# EAGLE design 1280 V2 SMPS (EAGLE 8.2.2)

## Sheet 1 of 3
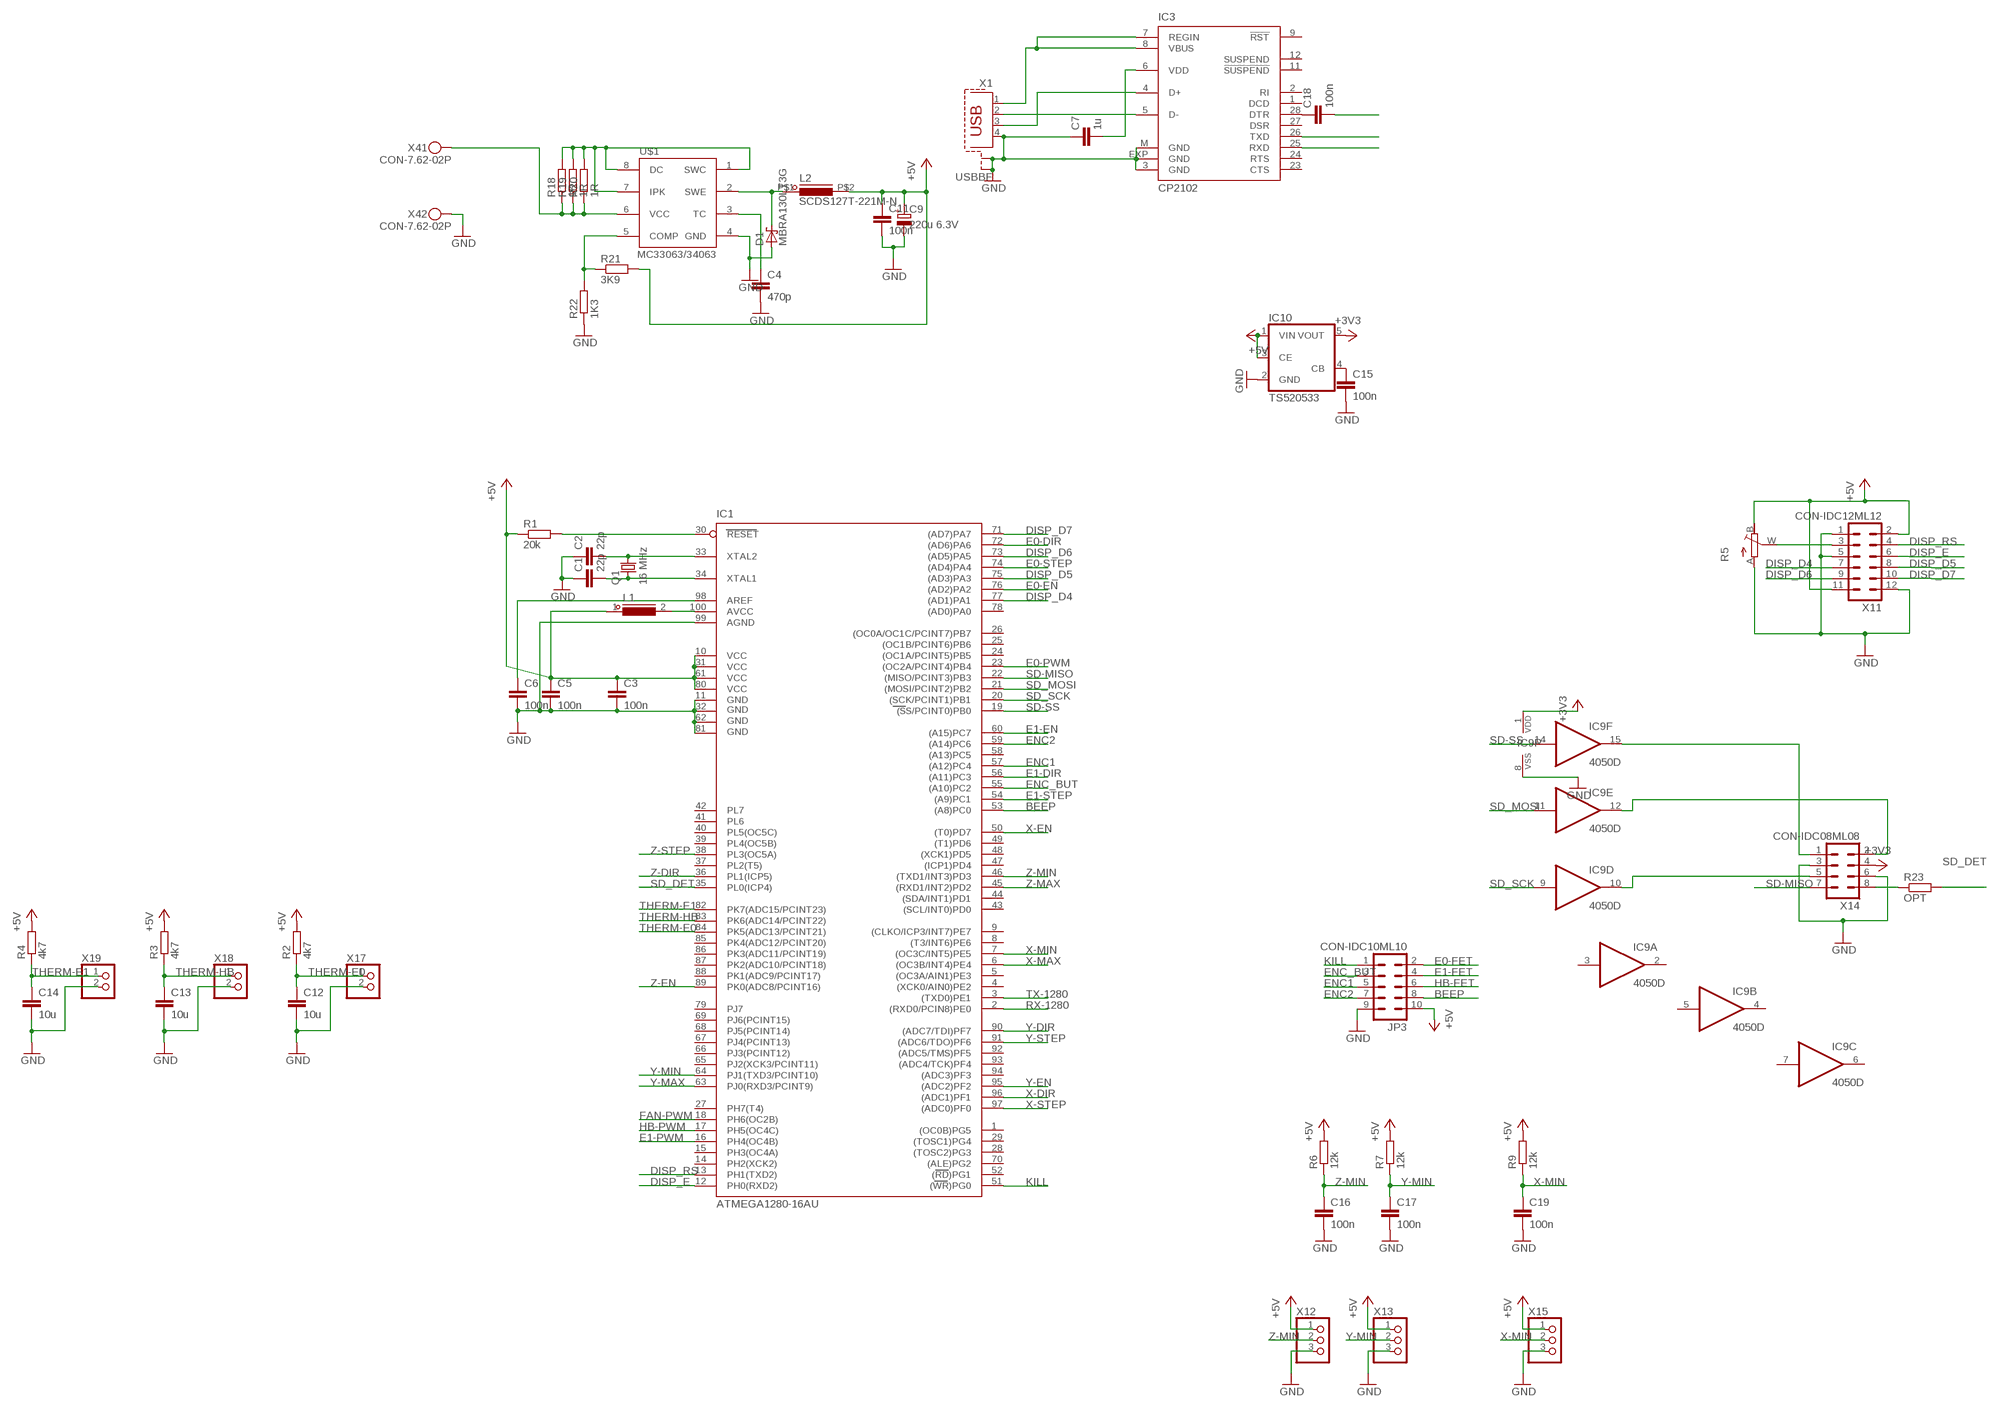
[diagram p0: schematic, sheet 1]

### Parts
C1  22p  CAP_0805  [C0805]
C2  22p  CAP_0805  [C0805]
C3  100n  CAP_0805  [C0805]
C4  470p  CAP_0805  [C0805]
C5  100n  CAP_0805  [C0805]
C6  100n  CAP_0805  [C0805]
C7  1u  CAP_0805  [C0805]
C9  220u 6.3V  CAP-POL_D6  [153CLV-0605]
C11  100n  CAP_0805  [C0805]
C12  10u  CAP_1210  [C1210]
C13  10u  CAP_1210  [C1210]
C14  10u  CAP_1210  [C1210]
C15  100n  CAP_0805  [C0805]
C16  100n  CAP_0805  [C0805]
C17  100n  CAP_0805  [C0805]
C18  100n  CAP_0805  [C0805]
C19  100n  CAP_0805  [C0805]
D1  MBRA130LT3G  DIODE-SH_SMA  [DO214AC]
IC1  ATMEGA1280-16AU  [TQFP100]
IC3  CP2102  [MLP28]
IC9  4050D  [SO16]
IC10  TS520533  [SOT25]
JP3  CON-IDC10ML10  [ML10]
L1  INDUCTOR1210  [C1210]
L2  SCDS127T-221M-N  INDUCTOR0705  [SCD-0705]
Q1  16 MHz  CRYSTAL3225  [CRYSTAL-3225]
R1  20k  R_0805  [R0805]
R2  4k7  R_0805  [R0805]
R3  4k7  R_0805  [R0805]
R4  4k7  R_0805  [R0805]
R5  R_POTTURN-X  [RJ9W]
R6  12k  R_0805  [R0805]
R7  12k  R_0805  [R0805]
R9  12k  R_0805  [R0805]
R18  1R  R_0805  [R0805]
R19  1R  R_0805  [R0805]
R20  1R  R_0805  [R0805]
R21  3K9  R_0805  [R0805]
R22  1K3  R_0805  [R0805]
R23  OPT  R_0805  [R0805]
U$1  MC33063/MC34063D  [SO08]
X1  USBBF  [PN61729-S]
X4  CON-7.62-02P  [KF25C-7.62-02P-13]
X11  CON-IDC12ML12  [ML12]
X12  PINHD-1X3  [1X03]
X13  PINHD-1X3  [1X03]
X14  CON-IDC08ML08  [ML08]
X15  PINHD-1X3  [1X03]
X17  PINHD-1X2  [1X02]
X18  PINHD-1X2  [1X02]
X19  PINHD-1X2  [1X02]

### Nets
!RST: C18.2 IC1.30(RESET) R1.2
+3V3: IC9.1(P:VDD) IC10.5(VOUT) X14.4
+5V: C3.1 C5.1 C9.+ C11.1 IC1.10(VCC) IC1.31(VCC1) IC1.61(VCC2) IC1.80(VCC3) IC10.1(VIN) IC10.3(CE) JP3.10 L1.1 L2.P$2 R1.1 R2.2 R3.2 R4.2 R5.B(E) R6.2 R7.2 R9.2 R21.2 X11.2 X11.11 X12.1 X13.1 X15.1 ; also sheet 3
AREF: C6.1 IC1.98(AREF)
AVCC: IC1.100(AVCC) L1.2
BEEP: IC1.53((A8)PC0) JP3.8
DISP_D4: IC1.77((AD1)PA1) X11.7
DISP_D5: IC1.75((AD3)PA3) X11.8
DISP_D6: IC1.73((AD5)PA5) X11.9
DISP_D7: IC1.71((AD7)PA7) X11.10
DISP_E: IC1.12(PH0(RXD2)) X11.6
DISP_RS: IC1.13(PH1(TXD2)) X11.4
E0-DIR: IC1.72((AD6)PA6) ; also sheet 3
E0-EN: IC1.76((AD2)PA2) ; also sheet 3
E0-FET: JP3.2 ; also sheet 2
E0-PWM: IC1.23((OC2A/PCINT4)PB4) ; also sheet 2
E0-STEP: IC1.74((AD4)PA4) ; also sheet 3
E1-DIR: IC1.56((A11)PC3) ; also sheet 3
E1-EN: IC1.60((A15)PC7) ; also sheet 3
E1-FET: JP3.4 ; also sheet 2
E1-PWM: IC1.16(PH4(OC4B)) ; also sheet 2
E1-STEP: IC1.54((A9)PC1) ; also sheet 3
ENC1: IC1.57((A12)PC4) JP3.5
ENC2: IC1.59((A14)PC6) JP3.7
ENC_BUT: IC1.55((A10)PC2) JP3.3
FAN-PWM: IC1.18(PH6(OC2B)) ; also sheet 2
GND: C1.1 C2.1 C3.2 C4.2 C5.2 C6.2 C7.1 C9.- C11.2 C12.2 C13.2 C14.2 C15.2 C16.2 C17.2 C19.2 D1.A IC1.11(GND) IC1.32(GND1) IC1.62(GND2) IC1.81(GND3) IC1.99(AGND) IC3.3(GND) IC3.EXP(GND) IC3.M(GND) IC9.8(P:VSS) IC10.2(GND) JP3.9 R5.A R22.1 U$1.4(GND) X1.4(GND) X1.S1 X1.S2 X4.P$2 X11.1 X11.5 X11.12 X12.3 X13.3 X14.3 X14.6 X15.3 X17.2 X18.2 X19.2 ; also sheet 2,3
HB-FET: JP3.6 ; also sheet 2
HB-PWM: IC1.17(PH5(OC4C)) ; also sheet 2
KILL: IC1.51((WR)PG0) JP3.1
N$1: IC3.5(D-) X1.2(D-)
N$2: IC3.4(D+) X1.3(D+)
N$4: C7.2 IC3.6(VDD)
N$44: C18.1 IC3.28(DTR)
N$45: IC3.7(REGIN) IC3.8(VBUS) X1.1(VCC)
N$47: R5.W(S) X11.3
N$48: R23.1 X14.8
N$49: IC9.15(F:O) X14.1
N$50: IC9.12(E:O) X14.2
N$51: IC9.10(D:O) X14.5
N$52: C15.1 IC10.4(CB)
N$55: R18.2 R19.2 R20.2 U$1.1(SWC) U$1.7(IPK) U$1.8(DC)
N$56: D1.C L2.P$1 U$1.2(SWE)
N$57: C4.1 U$1.3(TC)
N$59: R21.1 R22.2 U$1.5(COMP)
RX-1280: IC1.2((RXD0/PCIN8)PE0) IC3.26(TXD)
SD-MISO: IC1.22((MISO/PCINT3)PB3) X14.7
SD-SS: IC1.19((SS/PCINT0)PB0) IC9.14(F:I)
SD_DET: IC1.35(PL0(ICP4)) R23.2
SD_MOSI: IC1.21((MOSI/PCINT2)PB2) IC9.11(E:I)
SD_SCK: IC1.20((SCK/PCINT1)PB1) IC9.9(D:I)
THERM-E0: C12.1 IC1.84(PK5(ADC13/PCINT21)) R2.1 X17.1
THERM-E1: C14.1 IC1.82(PK7(ADC15/PCINT23)) R4.1 X19.1
THERM-HB: C13.1 IC1.83(PK6(ADC14/PCINT22)) R3.1 X18.1
TX-1280: IC1.3((TXD0)PE1) IC3.25(RXD)
V-IN: R18.1 R19.1 R20.1 U$1.6(VCC) X4.P$1 ; also sheet 2,3
X-DIR: IC1.96((ADC1)PF1) ; also sheet 3
X-EN: IC1.50((T0)PD7) ; also sheet 3
X-MAX: IC1.6((OC3B/INT4)PE4)
X-MIN: C19.1 IC1.7((OC3C/INT5)PE5) R9.1 X15.2
X-STEP: IC1.97((ADC0)PF0) ; also sheet 3
XTAL1: C1.2 IC1.34(XTAL1) Q1.P$2
XTAL2: C2.2 IC1.33(XTAL2) Q1.P$4
Y-DIR: IC1.90((ADC7/TDI)PF7) ; also sheet 3
Y-EN: IC1.95((ADC2)PF2) ; also sheet 3
Y-MAX: IC1.63(PJ0(RXD3/PCINT9))
Y-MIN: C17.1 IC1.64(PJ1(TXD3/PCINT10)) R7.1 X13.2
Y-STEP: IC1.91((ADC6/TDO)PF6) ; also sheet 3
Z-DIR: IC1.36(PL1(ICP5)) ; also sheet 3
Z-EN: IC1.89(PK0(ADC8/PCINT16)) ; also sheet 3
Z-MAX: IC1.45((RXD1/INT2)PD2)
Z-MIN: C16.1 IC1.46((TXD1/INT3)PD3) R6.1 X12.2
Z-STEP: IC1.38(PL3(OC5A)) ; also sheet 3
Unconnected: IC1.1((OC0B)PG5) IC1.4((XCK0/AIN0)PE2) IC1.5((OC3A/AIN1)PE3) IC1.8((T3/INT6)PE6) IC1.9((CLKO/ICP3/INT7)PE7) IC1.14(PH2(XCK2)) IC1.15(PH3(OC4A)) IC1.24((OC1A/PCINT5)PB5) IC1.25((OC1B/PCINT6)PB6) IC1.26((OC0A/OC1C/PCINT7)PB7) IC1.27(PH7(T4)) IC1.28((TOSC2)PG3) IC1.29((TOSC1)PG4) IC1.37(PL2(T5)) IC1.39(PL4(OC5B)) IC1.40(PL5(OC5C)) IC1.41(PL6) IC1.42(PL7) IC1.43((SCL/INT0)PD0) IC1.44((SDA/INT1)PD1) IC1.47((ICP1)PD4) IC1.48((XCK1)PD5) IC1.49((T1)PD6) IC1.52((RD)PG1) IC1.58((A13)PC5) IC1.65(PJ2(XCK3/PCINT11)) IC1.66(PJ3(PCINT12)) IC1.67(PJ4(PCINT13)) IC1.68(PJ5(PCINT14)) IC1.69(PJ6(PCINT15)) IC1.70((ALE)PG2) IC1.78((AD0)PA0) IC1.79(PJ7) IC1.85(PK4(ADC12/PCINT20)) IC1.86(PK3(ADC11/PCINT19)) IC1.87(PK2(ADC10/PCINT18)) IC1.88(PK1(ADC9/PCINT17)) IC1.92((ADC5/TMS)PF5) IC1.93((ADC4/TCK)PF4) IC1.94((ADC3)PF3) IC3.1(DCD) IC3.2(RI) IC3.9(!RST) IC3.11(!SUSPEND) IC3.12(SUSPEND) IC3.23(CTS) IC3.24(RTS) IC3.27(DSR) IC9.2(A:O) IC9.3(A:I) IC9.4(B:O) IC9.5(B:I) IC9.6(C:O) IC9.7(C:I)

## Sheet 2 of 3
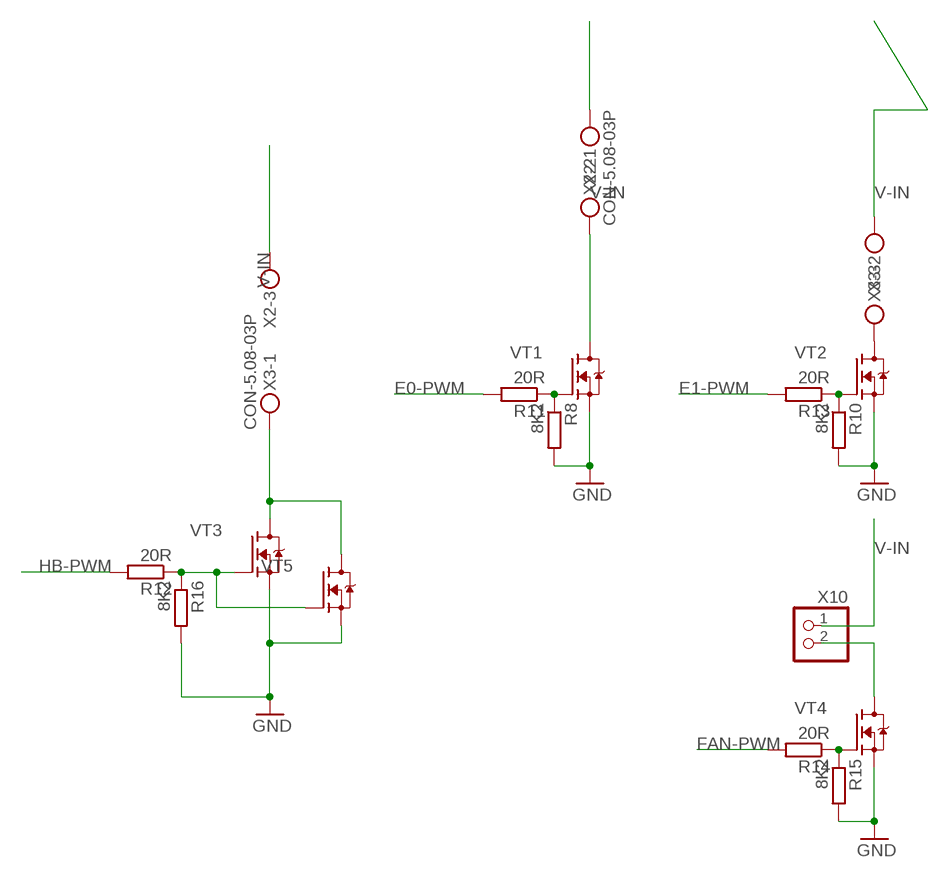
[diagram p1: schematic, sheet 2]

### Parts
R8  8K2  R_0805  [R0805]
R10  8K2  R_0805  [R0805]
R11  20R  R_0805  [R0805]
R12  20R  R_0805  [R0805]
R13  20R  R_0805  [R0805]
R14  20R  R_0805  [R0805]
R15  8K2  R_0805  [R0805]
R16  8K2  R_0805  [R0805]
VT1  FET-NPF-6X5  [POWERFLAT-5X6]
VT2  FET-NPF-6X5  [POWERFLAT-5X6]
VT3  FET-NPF-6X5  [POWERFLAT-5X6]
VT4  FET-NPF-6X5  [POWERFLAT-5X6]
VT5  FET-NPF-6X5  [POWERFLAT-5X6]
X2  CON-5.08-03P  [MKDSN1,5/3-5,08]
X3  CON-5.08-03P  [MKDSN1,5/3-5,08]
X10  PINHD-1X2  [1X02]

### Nets
E0-: VT1.D1(D) X2.2
E0-FET: R8.1 R11.1 VT1.G ; also sheet 1
E0-PWM: R11.2 ; also sheet 1
E1-FET: R10.1 R13.1 VT2.G ; also sheet 1
E1-PWM: R13.2 ; also sheet 1
FAN-: VT4.D1(D) X10.2
FAN-PWM: R14.2 ; also sheet 1
GND: R8.2 R10.2 R15.2 R16.2 VT1.S1(S) VT1.S2(S) VT1.S3(S) VT2.S1(S) VT2.S2(S) VT2.S3(S) VT3.S1(S) VT3.S2(S) VT3.S3(S) VT4.S1(S) VT4.S2(S) VT4.S3(S) VT5.S1(S) VT5.S2(S) VT5.S3(S) ; also sheet 1,3
HB-: VT3.D1(D) VT5.D1(D) X3.1
HB-FET: R12.1 R16.1 VT3.G VT5.G ; also sheet 1
HB-PWM: R12.2 ; also sheet 1
N$46: R14.1 R15.1 VT4.G
N$53: VT2.D1(D) X3.3
V-IN: X2.1 X2.3 X3.2 X10.1 ; also sheet 1,3

## Sheet 3 of 3
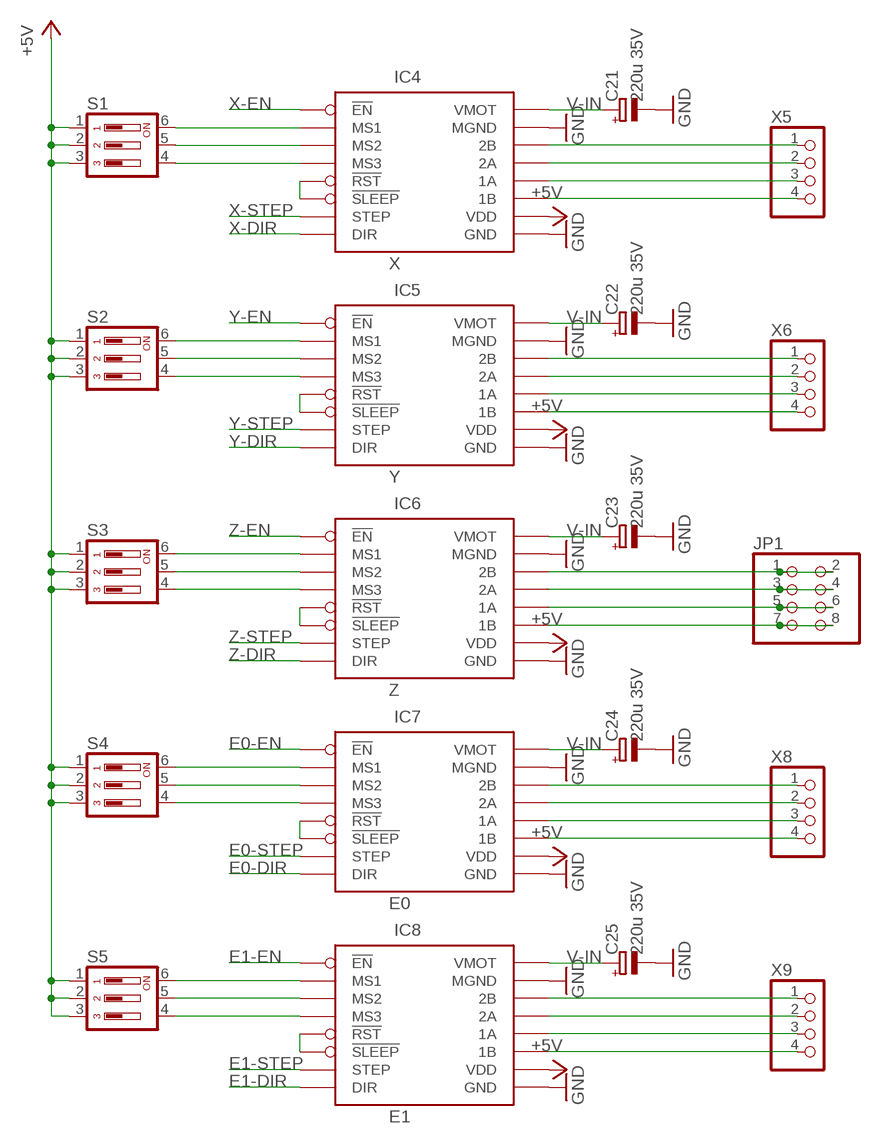
[diagram p2: schematic, sheet 3]

### Parts
C21  220u 35V  CAP-POL_E3,5-8-11H  [E3.5-8-11H]
C22  220u 35V  CAP-POL_E3,5-8-11H  [E3.5-8-11H]
C23  220u 35V  CAP-POL_E3,5-8-11H  [E3.5-8-11H]
C24  220u 35V  CAP-POL_E3,5-8-11H  [E3.5-8-11H]
C25  220u 35V  CAP-POL_E3,5-8-11H  [E3.5-8-11H]
IC4  X  STEP-DRV  [DRV-BRK]
IC5  Y  STEP-DRV  [DRV-BRK]
IC6  Z  STEP-DRV  [DRV-BRK]
IC7  E0  STEP-DRV  [DRV-BRK]
IC8  E1  STEP-DRV  [DRV-BRK]
JP1  PINHD-2X4/90  [2X04/90]
S1  SW-DIP03S  [DIP03YL]
S2  SW-DIP03S  [DIP03YL]
S3  SW-DIP03S  [DIP03YL]
S4  SW-DIP03S  [DIP03YL]
S5  SW-DIP03S  [DIP03YL]
X5  PINHD-1X4/90  [1X04/90]
X6  PINHD-1X4/90  [1X04/90]
X8  PINHD-1X4/90  [1X04/90]
X9  PINHD-1X4/90  [1X04/90]

### Nets
+5V: IC4.P$10(VDD) IC5.P$10(VDD) IC6.P$10(VDD) IC7.P$10(VDD) IC8.P$10(VDD) S1.1 S1.2 S1.3 S2.1 S2.2 S2.3 S3.1 S3.2 S3.3 S4.1 S4.2 S4.3 S5.1 S5.2 S5.3 ; also sheet 1
E0-DIR: IC7.P$8(DIR) ; also sheet 1
E0-EN: IC7.P$1(!EN) ; also sheet 1
E0-STEP: IC7.P$7(STEP) ; also sheet 1
E1-DIR: IC8.P$8(DIR) ; also sheet 1
E1-EN: IC8.P$1(!EN) ; also sheet 1
E1-STEP: IC8.P$7(STEP) ; also sheet 1
GND: C21.- C22.- C23.- C24.- C25.- IC4.P$9(GND) IC4.P$15(MGND) IC5.P$9(GND) IC5.P$15(MGND) IC6.P$9(GND) IC6.P$15(MGND) IC7.P$9(GND) IC7.P$15(MGND) IC8.P$9(GND) IC8.P$15(MGND) ; also sheet 1,2
N$3: IC4.P$14(2B) X5.1
N$5: IC4.P$13(2A) X5.2
N$6: IC4.P$12(1A) X5.3
N$7: IC4.P$5(!RST) IC4.P$6(!SLEEP)
N$8: IC5.P$5(!RST) IC5.P$6(!SLEEP)
N$9: IC4.P$11(1B) X5.4
N$10: IC7.P$5(!RST) IC7.P$6(!SLEEP)
N$11: IC6.P$5(!RST) IC6.P$6(!SLEEP)
N$12: IC5.P$14(2B) X6.1
N$13: IC5.P$13(2A) X6.2
N$14: IC8.P$5(!RST) IC8.P$6(!SLEEP)
N$15: IC5.P$12(1A) X6.3
N$16: IC5.P$11(1B) X6.4
N$17: IC6.P$14(2B) JP1.1 JP1.2
N$18: IC6.P$13(2A) JP1.3 JP1.4
N$19: IC6.P$12(1A) JP1.5 JP1.6
N$20: IC6.P$11(1B) JP1.7 JP1.8
N$21: IC7.P$14(2B) X8.1
N$22: IC7.P$13(2A) X8.2
N$23: IC7.P$12(1A) X8.3
N$24: IC7.P$11(1B) X8.4
N$25: IC8.P$14(2B) X9.1
N$26: IC8.P$13(2A) X9.2
N$27: IC8.P$12(1A) X9.3
N$28: IC8.P$11(1B) X9.4
N$29: IC4.P$4(MS3) S1.4
N$30: IC4.P$3(MS2) S1.5
N$31: IC4.P$2(MS1) S1.6
N$32: IC5.P$2(MS1) S2.6
N$33: IC5.P$3(MS2) S2.5
N$34: IC5.P$4(MS3) S2.4
N$35: IC6.P$2(MS1) S3.6
N$36: IC6.P$3(MS2) S3.5
N$37: IC6.P$4(MS3) S3.4
N$38: IC7.P$2(MS1) S4.6
N$39: IC7.P$3(MS2) S4.5
N$40: IC7.P$4(MS3) S4.4
N$41: IC8.P$2(MS1) S5.6
N$42: IC8.P$3(MS2) S5.5
N$43: IC8.P$4(MS3) S5.4
V-IN: C21.+ C22.+ C23.+ C24.+ C25.+ IC4.P$16(VMOT) IC5.P$16(VMOT) IC6.P$16(VMOT) IC7.P$16(VMOT) IC8.P$16(VMOT) ; also sheet 1,2
X-DIR: IC4.P$8(DIR) ; also sheet 1
X-EN: IC4.P$1(!EN) ; also sheet 1
X-STEP: IC4.P$7(STEP) ; also sheet 1
Y-DIR: IC5.P$8(DIR) ; also sheet 1
Y-EN: IC5.P$1(!EN) ; also sheet 1
Y-STEP: IC5.P$7(STEP) ; also sheet 1
Z-DIR: IC6.P$8(DIR) ; also sheet 1
Z-EN: IC6.P$1(!EN) ; also sheet 1
Z-STEP: IC6.P$7(STEP) ; also sheet 1

## Library data of the parts
C1-C7 C11-C19 = Namenlos:CAP_
C9 C21-C25 = Namenlos:CAP-POL_
D1 = Namenlos:DIODE-SH_
IC1 = Namenlos:ATMEGA*: MICROCONTROLLER 64/128/256 Kbytes FLASH 4 Kbytes EEPROM 8 Kbytes SRAM 86 General Purpose I/O pins 12-channels16-bit PWM 4 x Serial USARTs 16-channels 10-bit A/D
IC3 = Namenlos:CP210*: Single-Chip USB to UART Bridge Source: www.silabs.com .. CP2101.pdf / cp2102.pdf; MF: FARNELL; MPN: CP2102-GM; OC_FARNELL: 9282130; OC_NEWARK: 30K5635
IC4-IC8 = Namenlos:STEP-DRV
IC9 = 40xx:4050: Hex non-inverting BUFFER
IC10 = v-reg:TS5205: 150mA Low Noise LDO Voltage Regulator with Enable TSC [Taiwan Semiconductor Company, Ltd] Source: http://www.taiwansemi.com .. 5205_0409c.pdf
JP1 = pinhead:PINHD-2X4: PIN HEADER
JP3 = Namenlos:CON-IDC10: HARTING
L1 L2 = Namenlos:INDUCTOR
Q1 = Namenlos:CRYSTAL
R1-R4 R6-R16 R18-R23 = Namenlos:R_
R5 = Namenlos:R_POT
S1-S5 = Namenlos:SW-DIP03S: DIL/CODE SWITCH; OC_FARNELL: unknown; OC_NEWARK: unknown
U$1 = adafruit:MC33063/MC34063: MC33063 and MC34063 Basic DC/DC converter with internal power-NPN transistor, 100KHz, 1.5A peak switch current. 3-40 input/output.
VT1-VT5 = Namenlos:FET-N
X1 = Namenlos:USB
X2 X3 = Namenlos:CON-5.08-03P: MKDSN 1,5/ 3-5,08 Printklemme Nennstrom: 13,5 A Nennspannung: 250 V Rastermaß: 5,08 mm Polzahl: 3 Anschlussart: Schraubanschluss Montage: Löten Anschlussrichtung Leiter/Platine: 0 ° Artikelnummer: 1729131 Source: http://eshop.phoenixcontact.com .. 1729131.pdf
X4 = Namenlos:CON-7.62-02P
X5 X6 X8 X9 = pinhead:PINHD-1X4: PIN HEADER
X10 X17-X19 = pinhead:PINHD-1X2: PIN HEADER
X11 = Namenlos:CON-IDC12
X12 X13 X15 = pinhead:PINHD-1X3: PIN HEADER
X14 = Namenlos:CON-IDC08

## Board
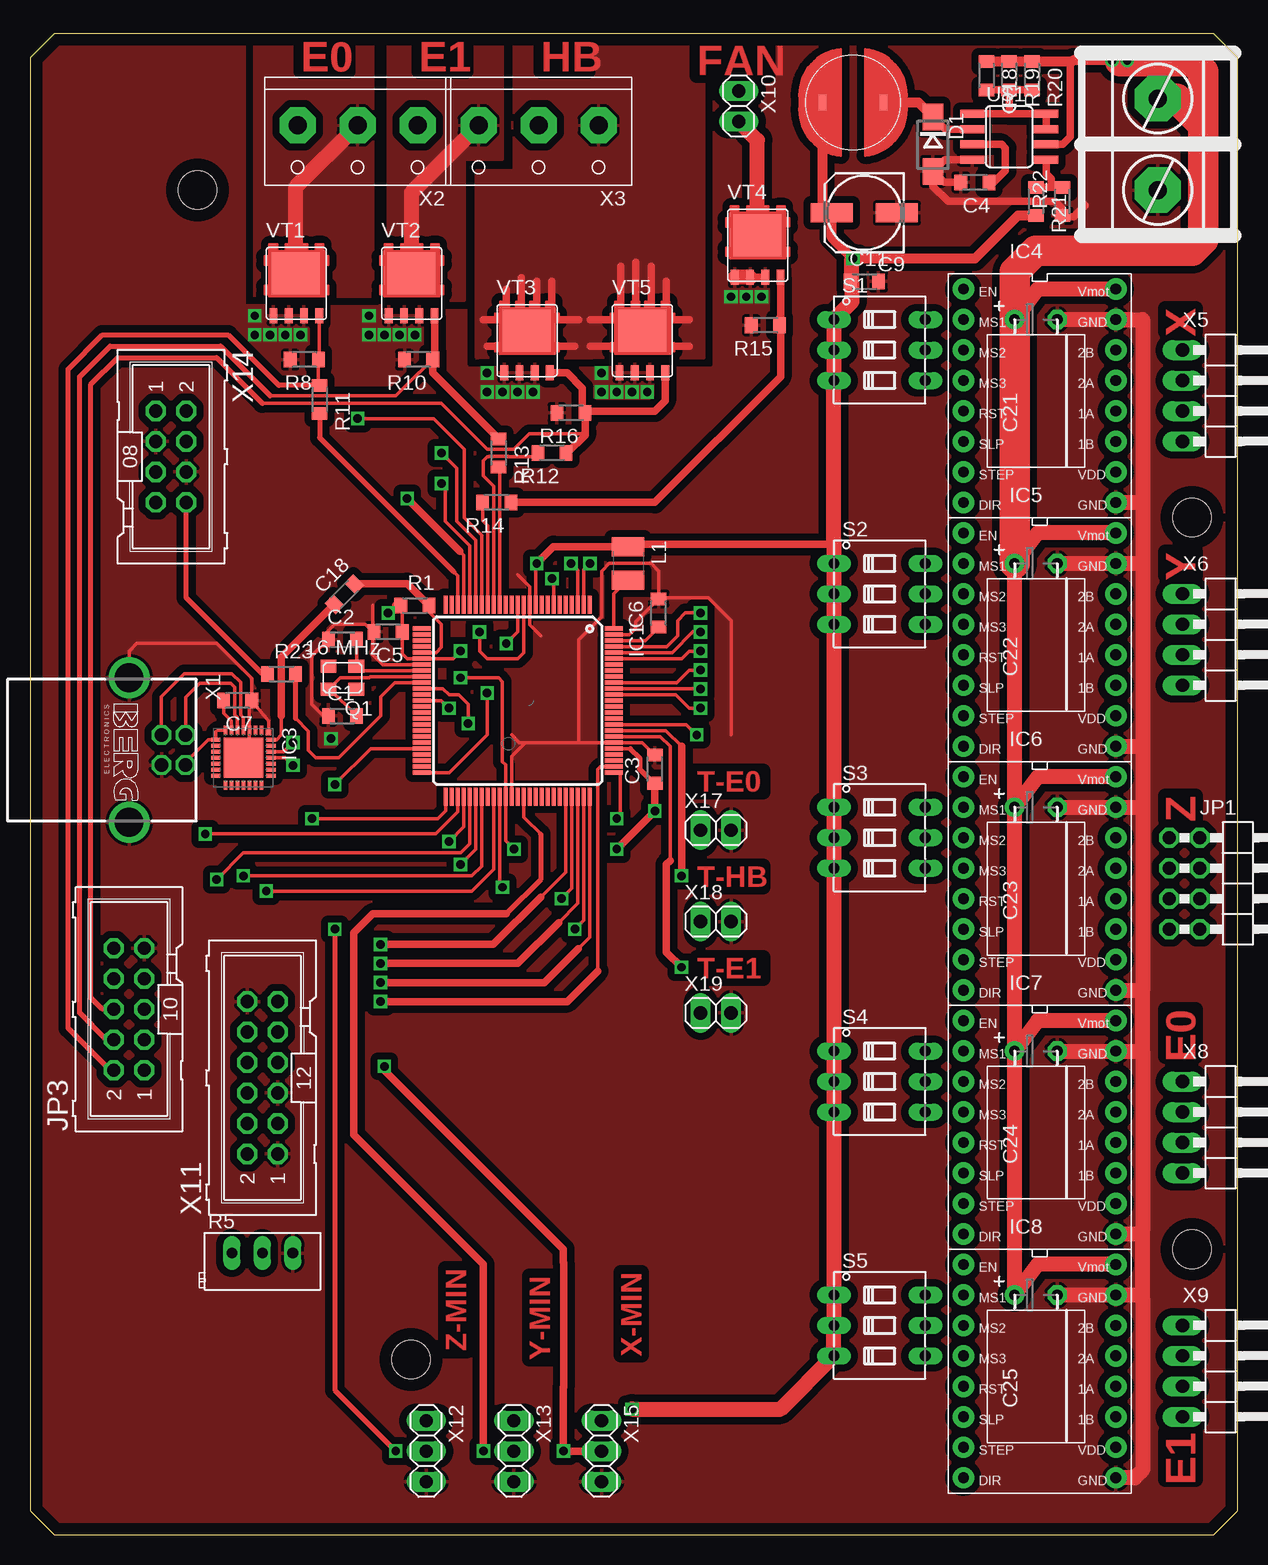
[diagram p3: board, top side]
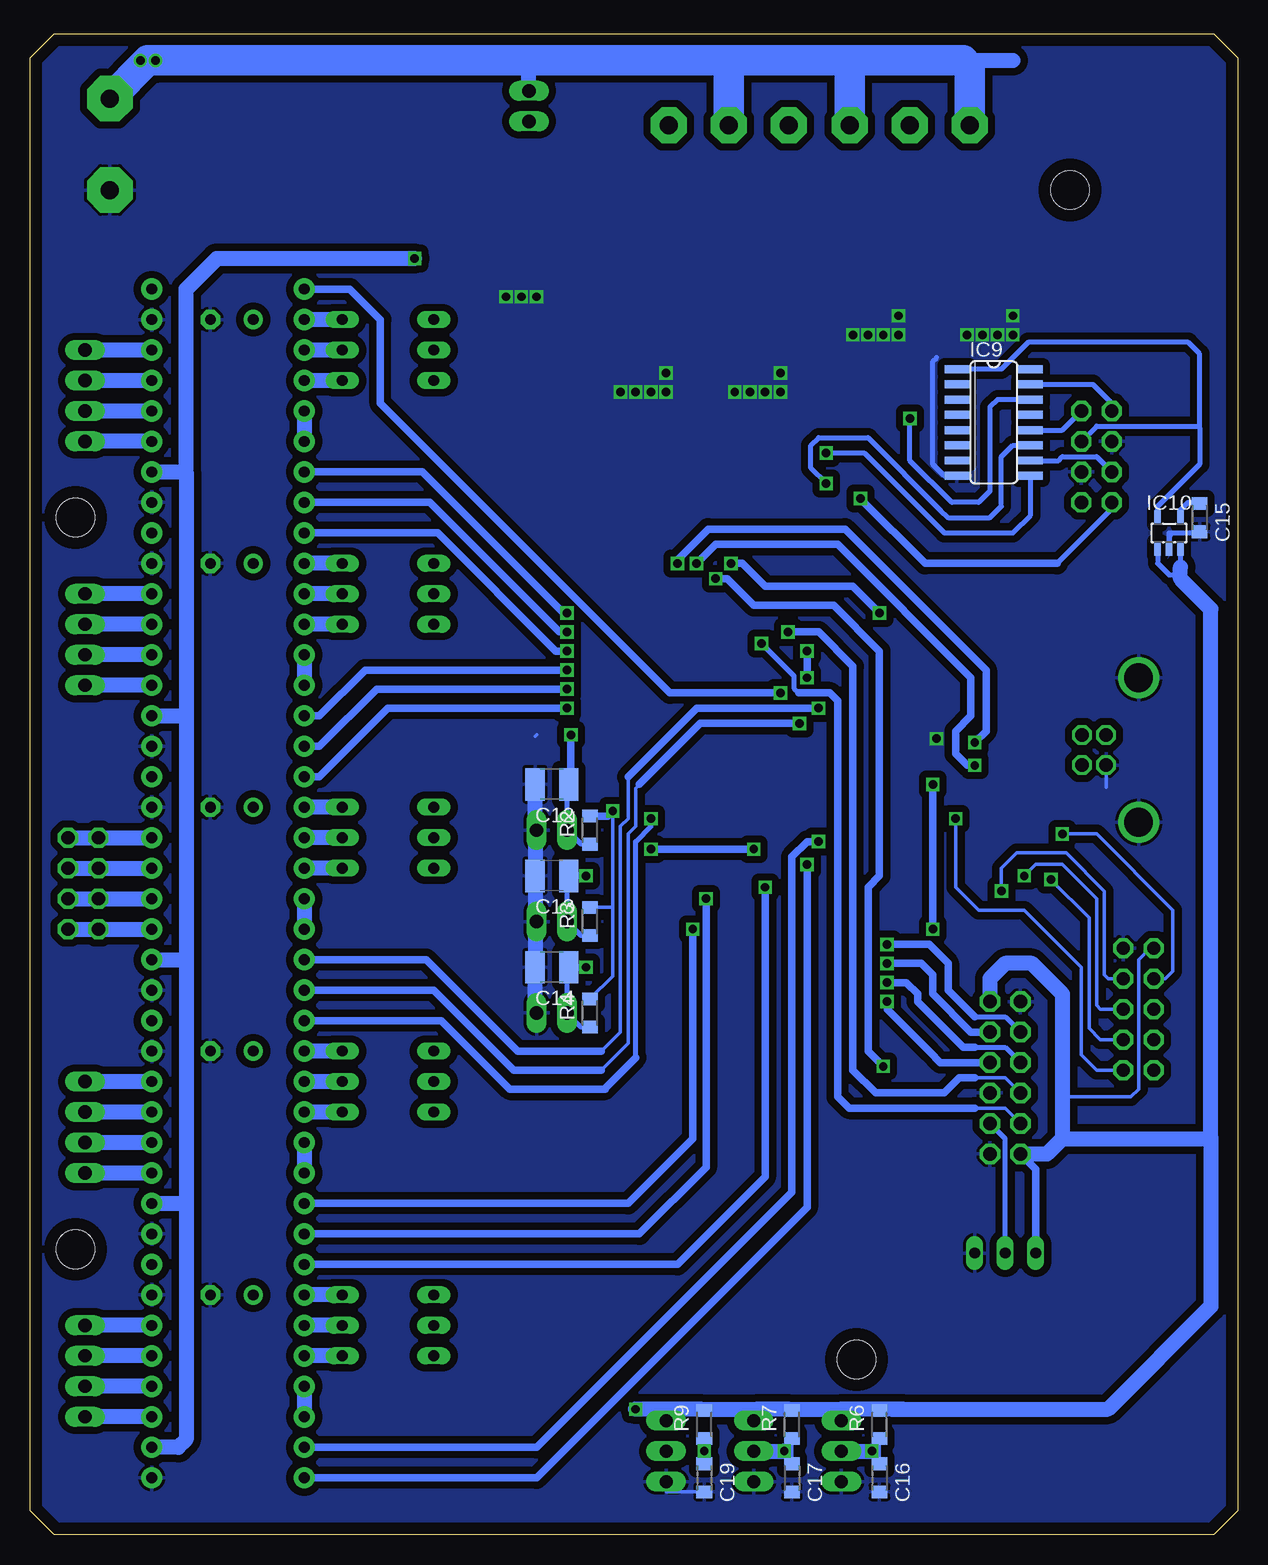
[diagram p4: board, bottom side, seen from below]

Size 100.64 x 125.07 mm. Coordinates in mm from the lower left corner, seen from the top.
Outline: 100.64,2 100.64,123.07 98.64,125.07 2,125.07 0,123.07 0,2 2,0 98.64,0 100.64,2
Copper layers (1*16): Top 0.035mm / dielectric 1.5mm / Bottom 0.035mm
Design rules "EagleDesignRules": minimum track width 0.2mm, minimum drill 0.3mm, track to track 0.2mm, track to pad 0.2mm, pad to pad 0.2mm, via to via 0.2mm, smd to smd 0.2mm, copper to edge 1mm, drill to drill 0.2mm, minimum pad ring 10mil, minimum via ring 8mil, stop-mask expansion 4mil, vias tented up to drill 0mil, thermal gap 0.25mm
Holes 3.2 mm at 96.84,84.75 96.84,23.79 13.97,112.06 31.75,14.58

### Footprints (pad centres in the part's own frame; a part is rotated, then mirrored left to right if it is on the bottom)
C0805 = smd 1.05 x 1.3: 1 -1.175,0; 2 1.175,0
153CLV-0605 = smd 3.5 x 1.6: + 2.7,0; - -2.7,0
C1210 = smd 1.6 x 2.7: 1 -1.4,0; 2 1.4,0
E3.5-8-11H = drill 0.9 pad 1.6: + -1.778,0 | drill 0.9 pad 1.6 octagon: - 1.778,0
DO214AC = smd 2.2 x 1.7: A 2.25,0; C -2.285,0
TQFP100 = smd 1.5 x 0.35: 1 -8,6; 2 -8,5.5; 3 -8,5; 4 -8,4.5; 5 -8,4; 6 -8,3.5; 7 -8,3; 8 -8,2.5; 9 -8,2; 10 -8,1.5; 11 -8,1; 12 -8,0.5; 13 -8,0; 14 -8,-0.5; 15 -8,-1; 16 -8,-1.5; 17 -8,-2; 18 -8,-2.5; 19 -8,-3; 20 -8,-3.5; 21 -8,-4; 22 -8,-4.5; 23 -8,-5; 24 -8,-5.5; 25 -8,-6; 51 8,-6; 52 8,-5.5; 53 8,-5; 54 8,-4.5; 55 8,-4; 56 8,-3.5; 57 8,-3; 58 8,-2.5; 59 8,-2; 60 8,-1.5; 61 8,-1; 62 8,-0.5; 63 8,0; 64 8,0.5; 65 8,1; 66 8,1.5; 67 8,2; 68 8,2.5; 69 8,3; 70 8,3.5; 71 8,4; 72 8,4.5; 73 8,5; 74 8,5.5; 75 8,6 | smd 0.35 x 1.5: 26 -6,-8; 27 -5.5,-8; 28 -5,-8; 29 -4.5,-8; 30 -4,-8; 31 -3.5,-8; 32 -3,-8; 33 -2.5,-8; 34 -2,-8; 35 -1.5,-8; 36 -1,-8; 37 -0.5,-8; 38 0,-8; 39 0.5,-8; 40 1,-8; 41 1.5,-8; 42 2,-8; 43 2.5,-8; 44 3,-8; 45 3.5,-8; 46 4,-8; 47 4.5,-8; 48 5,-8; 49 5.5,-8; 50 6,-8; 76 6,8; 77 5.5,8; 78 5,8; 79 4.5,8; 80 4,8; 81 3.5,8; 82 3,8; 83 2.5,8; 84 2,8; 85 1.5,8; 86 1,8; 87 0.5,8; 88 0,8; 89 -0.5,8; 90 -1,8; 91 -1.5,8; 92 -2,8; 93 -2.5,8; 94 -3,8; 95 -3.5,8; 96 -4,8; 97 -4.5,8; 98 -5,8; 99 -5.5,8; 100 -6,8
MLP28 = smd 0.762 x 0.3: 1 -2.3,1.5; 2 -2.3,1; 3 -2.3,0.5; 4 -2.3,0; 5 -2.3,-0.5; 6 -2.3,-1; 7 -2.3,-1.5; 15 2.3,-1.5; 16 2.3,-1; 17 2.3,-0.5; 18 2.3,0; 19 2.3,0.5; 20 2.3,1; 21 2.3,1.5 | smd 0.3 x 0.762: 8 -1.5,-2.3; 9 -1,-2.3; 10 -0.5,-2.3; 11 0,-2.3; 12 0.5,-2.3; 13 1,-2.3; 14 1.5,-2.3; 22 1.5,2.3; 23 1,2.3; 24 0.5,2.3; 25 0,2.3; 26 -0.5,2.3; 27 -1,2.3; 28 -1.5,2.3 | smd 3.3 x 3.3: EXP 0,0 | smd 0.435 x 0.435: M -2.103,2.103
DRV-BRK = drill 0.9 pad 1.778: P$1 -8.89,-6.35; P$2 -6.35,-6.35; P$3 -3.81,-6.35; P$4 -1.27,-6.35; P$5 1.27,-6.35; P$6 3.81,-6.35; P$7 6.35,-6.35; P$8 8.89,-6.35; P$9 8.89,6.35; P$10 6.35,6.35; P$11 3.81,6.35; P$12 1.27,6.35; P$13 -1.27,6.35; P$14 -3.81,6.35; P$15 -6.35,6.35; P$16 -8.89,6.35
SO16 = smd 0.66 x 2.032: 1 -4.445,-3.073; 2 -3.175,-3.073; 3 -1.905,-3.073; 4 -0.635,-3.073; 5 0.635,-3.073; 6 1.905,-3.073; 7 3.175,-3.073; 8 4.445,-3.073; 9 4.445,3.073; 10 3.175,3.073; 11 1.905,3.073; 12 0.635,3.073; 13 -0.635,3.073; 14 -1.905,3.073; 15 -3.175,3.073; 16 -4.445,3.073
SOT25 = smd 0.55 x 1.2: 1 -0.95,-1.3; 2 0,-1.3; 3 0.95,-1.3; 4 0.95,1.3; 5 -0.95,1.3
2X04/90 = drill 1.1 pad 1.676 octagon: 1 -3.81,-6.35; 2 -3.81,-3.81; 3 -1.27,-6.35; 4 -1.27,-3.81; 5 1.27,-6.35; 6 1.27,-3.81; 7 3.81,-6.35; 8 3.81,-3.81
ML10 = drill 1.1 pad 1.676 octagon: 1 -5.08,-1.27; 2 -5.08,1.27; 3 -2.54,-1.27; 4 -2.54,1.27; 5 0,-1.27; 6 0,1.27; 7 2.54,-1.27; 8 2.54,1.27; 9 5.08,-1.27; 10 5.08,1.27
SCD-0705 = smd 1.27 x 0.635: P$1 0,2.54; P$2 0,-2.54
CRYSTAL-3225 = smd 1.3 x 1.1: GND@1 -1.15,0.95; GND@2 1.15,-0.95; P$2 1.15,0.95; P$4 -1.15,-0.95
R0805 = smd 1.05 x 1.3: 1 -1.175,0; 2 1.175,0
RJ9W = drill 0.9 long: A 2.54,0.635; B -2.54,0.635; W 0,0.635
DIP03YL = drill 0.9 long: 1 -2.54,-3.81; 2 0,-3.81; 3 2.54,-3.81; 4 2.54,3.81; 5 0,3.81; 6 -2.54,3.81
SO08 = smd 0.66 x 2.032: 1 -1.905,-3.073; 2 -0.635,-3.073; 3 0.635,-3.073; 4 1.905,-3.073; 5 1.905,3.073; 6 0.635,3.073; 7 -0.635,3.073; 8 -1.905,3.073
POWERFLAT-5X6 = smd 4 x 3.5: D1 -0.03,0.83 | smd 0.65 x 1.25: G 1.905,-2.685; S1 -1.905,-2.685; S2 -0.635,-2.685; S3 0.635,-2.685
PN61729-S = drill 1.1 octagon: 1 1.25,4.71; 2 -1.25,4.71; 3 -1.25,2.71; 4 1.25,2.71 | drill 2.4 pad 2.9: S1 -6.02,0; S2 6.02,0
MKDSN1,5/3-5,08 = drill 1.5 pad 3 octagon: 1 -5,0; 2 0,0; 3 5,0
KF25C-7.62-02P-13 = drill 1.5 pad 3.81 octagon: P$1 -3.81,0; P$2 3.81,0
1X04/90 = drill 1.1 long: 1 -3.81,-3.81; 2 -1.27,-3.81; 3 1.27,-3.81; 4 3.81,-3.81
1X02 = drill 1.1 long: 1 -1.27,0; 2 1.27,0
ML12 = drill 1.1 pad 1.676 octagon: 1 -6.35,-1.27; 2 -6.35,1.27; 3 -3.81,-1.27; 4 -3.81,1.27; 5 -1.27,-1.27; 6 -1.27,1.27; 7 1.27,-1.27; 8 1.27,1.27; 9 3.81,-1.27; 10 3.81,1.27; 11 6.35,-1.27; 12 6.35,1.27
1X03 = drill 1.1 long: 1 -2.54,0; 2 0,0; 3 2.54,0
ML08 = drill 1.1 pad 1.676 octagon: 1 -3.81,-1.27; 2 -3.81,1.27; 3 -1.27,-1.27; 4 -1.27,1.27; 5 1.27,-1.27; 6 1.27,1.27; 7 3.81,-1.27; 8 3.81,1.27

### Placement (x,y rotation side)
C1  26.04,68.24 0 top
C2  26.04,74.59 0 top
C3  52.07,63.8 90 top
C4  78.74,112.69 180 top
C5  29.85,75.23 180 top
C6  52.39,76.81 90 top
C7  17.3,69.51 180 top
C9  69.53,110.15 180 top
C11  69.53,104.44 0 top
C12  57.15,62.53 180 bottom
C13  57.15,54.91 180 bottom
C14  57.15,47.29 180 bottom
C15  3.18,84.75 270 bottom
C16  29.85,4.74 270 bottom
C17  37.15,4.74 270 bottom
C18  26.21,78.36 45 top
C19  44.45,4.74 270 bottom
C21  83.82,101.26 0 top
C22  83.82,80.94 0 top
C23  83.82,60.62 0 top
C24  83.82,40.3 0 top
C25  83.82,19.98 0 top
D1  75.25,115.87 270 top
IC1  40.64,69.51 270 top
IC3  17.78,64.75 270 top
IC4  84.14,94.91 270 top
IC5  84.14,74.59 270 top
IC6  84.14,54.27 270 top
IC7  84.14,33.95 270 top
IC8  84.14,13.63 270 top
IC9  20.32,92.69 270 bottom
IC10  5.71,83.48 0 bottom
JP1  101.28,54.27 270 top
JP3  8.25,43.8 90 top
L1  49.85,80.94 270 top
L2  68.58,119.36 270 top
Q1  26.04,71.42 180 top
R1  32.07,77.45 0 top
R2  53.97,58.72 90 bottom
R3  53.97,51.1 90 bottom
R4  53.97,43.48 90 bottom
R5  19.37,22.84 0 top
R6  29.85,9.19 90 bottom
R7  37.15,9.19 90 bottom
R8  22.86,97.93 180 top
R9  44.45,9.19 90 bottom
R10  32.38,97.93 180 top
R11  24.13,94.59 270 top
R12  43.5,90.15 180 top
R13  39.05,90.15 270 top
R14  38.89,86.02 180 top
R15  61.28,100.79 180 top
R16  45.09,93.48 180 top
R18  79.69,121.58 270 top
R19  81.6,121.58 270 top
R20  83.5,121.58 270 top
R21  83.82,111.1 270 top
R22  86.04,111.1 90 top
R23  20.96,71.73 0 top
S1  70.8,98.72 270 top
S2  70.8,78.4 270 top
S3  70.8,58.08 270 top
S4  70.8,37.76 270 top
S5  70.8,17.44 270 top
U$1  81.6,116.5 270 top
VT1  22.2,104.28 0 top
VT2  31.81,104.28 0 top
VT3  41.42,99.52 0 top
VT4  60.64,107.45 0 top
VT5  51.03,99.52 0 top
X1  8.25,65.38 270 top
X2  27.3,117.45 180 top
X3  42.39,117.45 180 top
X4  93.98,115.87 270 top
X5  99.85,94.91 270 top
X6  99.85,74.59 270 top
X8  99.85,33.95 270 top
X9  99.85,13.63 270 top
X10  59.05,119.04 270 top
X11  19.37,38.08 90 top
X12  33.02,6.96 270 top
X13  40.32,6.96 270 top
X14  11.75,89.83 270 top
X15  47.62,6.96 270 top
X17  57.15,58.72 0 top
X18  57.15,51.1 0 top
X19  57.15,43.48 0 top

### Tracks (layer width: path | path; a pad name or v marks a point on that pad's centre or on a via)
!RST
  Top 0.305: IC1.30 33.85,73.51 34.29,73.96 34.29,75.86 33.24,76.91 R1.2
  Top 0.61: R1.2 31.43,79.26 27.21,79.26 27.21,79.19 C18.2
+3V3
  Bottom 0.406: IC10.5 6.66,85.71 3.18,89.2 3.18,92.26 | 3.18,92.26 3.18,98.41 4.13,99.36 17.46,99.36 19.69,97.13 IC9.1 | X14.4 11.75,92.37 3.28,92.37 3.18,92.26
+5V  (via drill 0.7)
  Top 0.305: R1.1 31.02,77.32 C5.1 31.02,73.42 31.42,73.01 IC1.31 35.25,73.01 v35.88,73.64 | 30.48,77.45 v29.85,76.82 | IC1.10 42.14,80.85 v42.23,80.94 | IC1.80 50.04,65.51 | 50.8,64.75 50.8,63.89 C3.1 52.07,62.53 | 66.68,82.53 66.99,82.85 | v35.88,71.42 39.05,71.42 39.37,71.1 39.37,64.43 39.64,64.16 IC1.61 39.64,57.81 v40.32,57.13 | C11.1 68.48,104.44
  Top 0.406: 50.04,65.51 50.8,64.75 50.8,63.8 52.07,62.53
  Top 0.61: R1.1 30.48,77.45 | v48.89,57.13 v52.07,60.3 52.07,62.53 | v42.23,80.94 43.62,82.33 49.53,82.33 L1.1 50.03,82.53 66.68,82.53
  Top 0.813: R21.2 82.33,109.93 78.74,106.34 68.48,106.34 | L2.P$2 66.04,110.94 C9.+ 66.83,108.09 v68.58,106.34
  Top 1.27: v68.58,106.34 68.48,106.34 68.48,104.44 68.48,102.76 S1.1 S1.2 S1.3 66.99,82.85 S2.1 S2.2 S2.3 S3.1 S3.2 S3.3 S4.1 S4.2 S4.3 S5.1 S5.2 S5.3 62.55,10.46 v50.17,10.46
  Bottom 0.305: 52.48,59.89 v52.07,60.3 52.07,52.37 | 52.07,52.37 52.07,46.56 R4.2 | R3.2 52.17,52.27 52.07,52.37 | JP3.10 7.3,48.87 8.25,47.92 8.25,37.13 8.89,36.49 14.29,36.49 14.6,36.18
  Bottom 0.406: IC10.3 4.76,80.63 | IC10.1 6.66,80.94 5.71,79.99 5.08,79.99 4.76,79.67
  Bottom 0.61: v29.85,76.82 32.07,79.04 39.37,79.04 41.28,80.94 v42.23,80.94 | v35.88,73.64 v35.88,71.42 | 52.48,59.89 R2.2 | R7.2 37.37,10.36 37.46,10.46 | R6.2 29.85,10.46 | R9.2 44.67,10.36 44.77,10.46 | v40.32,57.13 v48.89,57.13 | R5.B 16.83,30.46 X11.2
  Bottom 1.27: v68.58,106.34 85.09,106.34 87.63,103.8 87.63,88.56 | 87.63,47.92 87.63,27.6 | 87.63,68.24 87.63,47.92 | 87.63,88.56 87.63,68.24 | 87.63,27.6 87.63,7.92 88.26,7.28 IC8.P$10 | IC7.P$10 87.63,27.6 | IC6.P$10 87.63,47.92 | IC5.P$10 87.63,68.24 | IC4.P$10 87.63,88.56 | 40,10.46 37.46,10.46 33.02,10.46 | 47.63,10.46 44.77,10.46 40,10.46 | 47.63,10.46 v50.17,10.46 | 33.02,10.46 29.85,10.46 28.89,10.46 | 27.94,10.46 28.89,10.46 | X12.1 33.02,10.46 | X13.1 40.32,10.14 40,10.46 | X15.1 47.63,10.46 | 2.22,33.05 2.22,19.03 10.8,10.46 28.89,10.46 | 2.22,33.05 2.22,77.13 4.76,79.67 4.76,80.63 | X11.11 20.64,46.33 19.37,47.61 17.14,47.61 14.6,45.07 14.6,36.18 14.6,33 | 14.6,33 15.87,31.73 X11.2 | 14.6,33 2.27,33 2.22,33.05
AREF
  Top 0.305: IC1.98 51.26,74.51 C6.1
AVCC
  Top 0.305: IC1.100 48.64,78.41 49.77,79.54 L1.2
BEEP  (via drill 0.7)
  Top 0.305: IC1.53 35.64,60.23 33.81,58.4 v14.6,58.4
  Bottom 0.305: JP3.8 6.03,46.33 5.4,46.97 5.4,52.05 11.75,58.4 v14.6,58.4
DISP_D4  (via drill 0.7)
  Top 0.305: IC1.77 47.52,64.01 47.31,63.8 47.31,46.97
  Top 0.61: v29.21,44.43 44.77,44.43 47.31,46.97
  Bottom 0.61: v29.21,44.43 29.21,43.8 25.61,40.2 24.76,39.35 X11.7
DISP_D5  (via drill 0.7)
  Top 0.305: IC1.75 46.64,49.8 45.69,48.84
  Top 0.61: v29.21,46.02 42.86,46.02 45.69,48.84
  Bottom 0.406: 21.91,40.62 19.37,40.62 X11.8
  Bottom 0.61: v29.21,46.02 27.62,46.02 26.67,45.07 26.67,44.43 22.86,40.62 21.91,40.62
DISP_D6  (via drill 0.7)
  Top 0.305: IC1.73 45.64,52.61 44.05,51.02
  Top 0.61: v29.21,47.61 40.64,47.61 44.05,51.02
  Bottom 0.61: v29.21,47.61 26.35,47.61 25.4,46.65 25.4,45.07 22.23,41.89 X11.9
DISP_D7  (via drill 0.7)
  Top 0.305: IC1.71 44.64,55.22 42.54,53.13
  Top 0.61: 42.54,53.13 38.61,49.19 v29.21,49.19
  Bottom 0.406: 21.91,43.16 19.37,43.16 X11.10
  Bottom 0.61: v29.21,49.19 25.72,49.19 24.13,47.61 24.13,45.38 21.91,43.16
DISP_E  (via drill 0.7)
  Top 0.305: IC1.12 41.14,73.51 40.64,73.01 38.1,73.01 37.46,73.64 v37.46,75.23
  Bottom 0.305: 21.91,38.08 19.37,38.08 X11.6
  Bottom 0.61: v37.46,75.23 34.92,75.23 32.07,72.37 32.07,40.62 | 32.07,40.62 | 32.07,40.62 32.07,38.72 30.16,36.81 24.45,36.81 23.18,38.08 21.91,38.08 | 32.07,40.3 32.07,40.62
DISP_RS  (via drill 0.7)
  Top 0.305: IC1.13 40.64,75.23 v39.69,74.27
  Bottom 0.305: 21.91,35.54 19.37,35.54 X11.4
  Bottom 0.406: 36.59,70.15 36.99,70.54 36.99,71.58 v39.69,74.27
  Bottom 0.61: 36.59,70.15 33.97,70.15 33.34,69.51 33.34,36.49 32.39,35.54 21.91,35.54
E0-
  Top 1.27: VT1.D1 22.17,112.32 X2.2
  pour Top (isolate 0.61): 28.57,125.07 28.57,103.17 18.73,103.17 18.73,125.07
E0-DIR  (via drill 0.7)
  Top 0.305: IC1.72 45.14,53.85 v44.29,53
  Bottom 0.61: v44.29,53 44.29,30.62 49.85,25.06 IC7.P$8
E0-EN  (via drill 0.7)
  Top 0.305: IC1.76 49.18,63.51 49.18,59.95 v48.89,59.67
  Bottom 0.406: v48.89,59.67 48.89,59.04 50.17,57.76 50.17,39.75
  Bottom 0.61: IC7.P$1 66.36,42.84 60.64,37.13 52.71,37.13 52.71,37.21 50.17,39.75
E0-FET
  Top 0.305: JP3.2 6.67,38.72 | VT1.G 24.1,97.99 R8.1 24.03,95.87 R11.1
  Top 0.406: 6.67,38.72 3.18,42.21 3.18,97.13 6.03,99.99 16.51,99.99 20.73,95.77 R11.1
E0-PWM
  Top 0.305: IC1.23 35.64,79.91 35.32,80.23
  Top 0.406: R11.2 24.13,91.42 35.32,80.23
E0-STEP  (via drill 0.7)
  Top 0.305: IC1.74 46.14,51.2 v45.4,50.46
  Bottom 0.61: v45.4,50.46 45.4,33 50.8,27.6 IC7.P$7
E1-DIR  (via drill 0.7)
  Top 0.305: IC1.56 37.14,57.12 v35.88,55.86
  Bottom 0.61: v35.88,55.86 35.88,27.28 58.42,4.74 IC8.P$8
E1-EN  (via drill 0.7)
  Top 0.305: v39.37,53.95 39.14,54.19 IC1.60
  Bottom 0.61: IC8.P$1 46.67,22.52 39.37,29.83 v39.37,53.95
E1-FET
  Top 0.305: JP3.4 6.35,41.26 | R10.1 32.45,96.82 32.39,96.82 30.48,94.91 24.95,94.91 24.93,94.89 23.33,94.89 23.31,94.91 20,94.91
  Top 0.406: 6.35,41.26 4.13,43.48 4.13,96.5 6.67,99.04 15.87,99.04 20,94.91
  Top 0.61: R13.1 33.56,96.82 R10.1 33.71,98.08 VT2.G
E1-PWM
  Top 0.305: R13.2 39.14,88.89 IC1.16
E1-STEP  (via drill 0.7)
  Top 0.305: IC1.54 36.14,58.98 v34.92,57.76
  Bottom 0.61: v34.92,57.76 35.88,57.76 37.15,56.5 37.15,28.55 58.42,7.28 IC8.P$7
ENC1  (via drill 0.7)
  Top 0.305: IC1.57 37.64,55.72 36.83,54.91 v17.78,54.91
  Bottom 0.305: JP3.5 11.43,43.8 11.75,44.11 11.75,53 14.6,55.86 16.83,55.86 v17.78,54.91
ENC2  (via drill 0.7)
  Top 0.305: IC1.59 38.64,55.45 36.83,53.64 20,53.64
  Top 0.61: 20,53.64 v19.69,53.64
  Bottom 0.305: JP3.7 10.8,46.33 11.11,46.65 11.11,53.64 14.29,56.81 18.42,56.81 19.69,55.54 v19.69,53.64
ENC_BUT  (via drill 0.7)
  Top 0.305: IC1.55 36.64,57.58 35.88,56.81 17.78,56.81 v15.56,54.59
  Bottom 0.305: JP3.3 11.43,41.26 12.38,42.21 12.38,51.41 v15.56,54.59
FAN-
  Top 1.27: VT4.D1 60.61,116.22 X10.2
FAN-PWM
  Top 0.305: IC1.18 38.14,84.08 37.72,84.5 R14.2
GND  (via drill 0.7)
  Top 0.305: IC3.EXP 18.28,65.25 IC3.3 18.28,69 C7.1 | IC3.M 19.88,67.79 C7.1 | C1.1 24.45,68.24 23.49,69.19 23.49,73.23 C2.1 24.76,74.69 24.76,75.23 25.4,75.86 27.94,75.86 28.57,75.23 C5.2 | IC1.32 29.39,72.51 28.57,73.32 28.57,75.13 C5.2 | 28.57,77.45 28.57,75.32 C5.2 | IC1.99 49.95,75.01 50.48,75.54 50.48,76.08 C6.2 | 41.28,66.01 40.78,66.01 40.14,66.66 | 41.28,66.01 45.72,66.01 | 45.72,66.01 IC1.81 51.03,66.01 C3.2 | 58.42,66.66 58.42,76.18 56.52,78.08 52.48,78.08 C6.2 | 40.64,79.99 41.64,78.99 IC1.11 41.64,75.82 42.54,74.91 | IC1.62 40.14,64.88 41.28,66.01 | 45.72,66.01 45.72,74.59 47.63,76.5 47.63,80.31 48.26,80.94 51.75,80.94 52.39,80.31 C6.2 | C7.1 18.48,71.35 15.56,74.27 8.89,74.27 8.25,73.64 X1.S1
  Top 0.61: VT4.S3 VT4.S2 | D1.A 75.85,113.01 | U$1.4 76.23,114.6 D1.A | C4.2 76.17,112.69 D1.A | 87.95,110.79 86.99,109.83 86.14,109.83 R22.1 86.04,110.47 85.41,111.1 76.52,111.1 75.25,112.38 D1.A
  Top 1.27: IC4.P$15 C21.- | C22.- IC5.P$15 92.71,80.94 | C23.- IC6.P$15 92.39,60.62 92.71,60.3 | C24.- IC7.P$15 92.71,40.3 | C25.- IC8.P$15 92.39,19.98 92.71,19.67 | 91.76,101.26 IC4.P$15 | 92.71,40.3 92.71,45.38 | 92.71,40.3 92.71,25.38 | 92.71,60.3 92.71,45.38 | 92.71,65.7 92.71,60.3 | 92.71,80.94 92.71,65.7 | 92.71,85.71 92.71,80.94 | 92.71,85.71 92.71,101.26 IC4.P$15 | 92.71,19.67 92.71,25.38 | 92.71,19.67 92.71,5.38 92.07,4.74 IC8.P$9 | IC7.P$9 92.39,25.06 92.71,25.38 | IC6.P$9 92.71,45.38 | IC5.P$9 92.71,65.7 | IC4.P$9 92.39,86.02 92.71,85.71 | VT4.S2 VT4.S1
  Bottom 0.305: 10.97,62.29 X1.4 | 58.55,66.52 58.42,66.66 | C19.2 47.63,3.57 X15.3
  Bottom 0.406: 5.4,83.48 5.71,83.16 IC10.2 5.71,83.48 3.27,83.48 C15.2 | IC9.8 24.45,88.24 25.4,89.2 25.4,97.77 25.08,98.09
  Bottom 1.27: 58.55,59.12 C12.2 | 58.55,51.5 C13.2 58.55,58.32 58.42,58.45 X17.2 | 58.55,43.88 C14.2 58.55,50.7 58.42,50.83 X18.2
  other vias: 41.91,95.23 38.1,96.82 38.1,95.23 39.37,95.23 40.64,95.23 47.62,96.82 47.62,95.23 48.89,95.23 50.16,95.23 51.43,95.23 58.42,103.17 59.69,103.17 60.96,103.17 32.07,99.99 30.8,99.99 29.53,99.99 28.26,99.99 28.26,101.58 22.54,99.99 21.27,99.99 20,99.99 18.73,99.99 18.73,101.58 25.08,66.34
  pour Top (isolate 0.61, rank 6): 0,123.17 0,1.98 2,-0.02 98.74,-0.02 100.65,1.89 100.65,122.85 98.43,125.07 1.91,125.07
  pour Bottom (isolate 0.61, rank 6): 0,123.17 1.91,125.07 98.74,125.07 100.65,123.17 100.65,1.89 98.74,-0.02 1.91,-0.02 0,1.89
HB-
  Top 0.61: VT5.D1 49.21,102.13 49.21,105.71 | VT5.D1 53.02,102.37 53.02,104.44 | VT5.D1 51.75,101.1 51.75,105.71 | VT5.D1 50.48,100.86 50.48,106.02 | VT5.D1 50.08,101.26 46.67,101.26 | VT5.D1 49.69,99.04 46.67,99.04 | VT5.D1 52.31,99.04 54.93,99.04 | VT5.D1 51.92,101.26 54.93,101.26 | VT3.D1 42.3,101.26 45.72,101.26 | VT3.D1 42.69,99.04 45.4,99.04 | VT3.D1 40.47,101.26 37.78,101.26 | VT3.D1 40.08,99.04 38.1,99.04 | VT3.D1 39.69,102.05 39.69,103.8 | VT3.D1 43.5,102.46 43.5,104.44 | VT3.D1 42.23,101.19 42.23,104.44 | VT3.D1 40.96,100.78 40.96,104.76
  pour Top (isolate 0.61): 40.32,125.07 40.32,113.64 37.15,113.64 37.15,98.09 56.2,98.09 56.2,125.07
HB-FET
  Top 0.305: 19.37,94.28 23.31,94.28 23.33,94.3 24.93,94.3 24.95,94.28 34.29,94.28 38.1,90.47 38.24,90.47 38.26,90.45 40.3,90.45 41.59,91.74 45.94,91.74 46.26,92.05
  Top 0.406: JP3.6 6.03,43.8 5.08,44.75 5.08,95.87 7.3,98.09 15.56,98.09 19.37,94.28
  Top 0.61: VT3.G 44.75,96.83 46.04,95.55 46.04,93.71 R16.1 | VT5.G 52.94,94.51 52.07,93.64 46.42,93.64 R16.1 | R16.1 46.26,92.05 46.26,91.64 44.77,90.15 R12.1
HB-PWM
  Top 0.305: IC1.17 38.64,87.39 37.78,88.24 37.78,89.52 38.1,89.83 38.24,89.83 38.26,89.85 39.85,89.85 39.87,89.83 42,89.83 R12.2
KILL  (via drill 0.7)
  Top 0.305: IC1.51 34.64,60.34 33.97,59.67 v23.49,59.67
  Bottom 0.305: JP3.1 11.75,38.72 13.02,39.98 13.02,47.29 17.78,52.05 21.59,52.05 23.49,53.95 v23.49,59.67
N$1
  Top 0.305: 12.97,67.55 X1.2 12.97,69.78 14.13,70.94 16.75,70.94 17.07,70.62 17.07,68.32 17.28,68.11 IC3.5
N$2
  Top 0.305: IC3.4 17.78,68.08 17.54,68.32 17.54,71.02 16.83,71.74 12.86,71.74 10.95,69.83 10.95,66.65 X1.3
N$3
  Bottom 1.27: IC4.P$14 X5.1
N$4
  Top 0.305: IC3.6 16.78,67.81 16.27,68.32 16.19,68.4 16.13,68.46 C7.2
N$5
  Bottom 1.27: IC4.P$13 X5.2
N$6
  Bottom 1.27: IC4.P$12 X5.3
N$7
  Bottom 1.27: IC4.P$5 IC4.P$6
N$8
  Bottom 1.27: IC5.P$5 IC5.P$6
N$9
  Bottom 1.27: IC4.P$11 X5.4
N$10
  Bottom 1.27: IC7.P$5 IC7.P$6
N$11
  Bottom 1.27: IC6.P$5 IC6.P$6
N$12
  Bottom 1.27: IC5.P$14 X6.1
N$13
  Bottom 1.27: IC5.P$13 X6.2
N$14
  Bottom 1.27: IC8.P$5 IC8.P$6
N$15
  Bottom 1.27: IC5.P$12 X6.3
N$16
  Bottom 1.27: IC5.P$11 X6.4
N$17
  Bottom 1.27: JP1.2 JP1.1 IC6.P$14
N$18
  Bottom 1.27: JP1.4 JP1.3 IC6.P$13
N$19
  Bottom 1.27: JP1.6 JP1.5 IC6.P$12
N$20
  Bottom 1.27: JP1.8 JP1.7 IC6.P$11
N$21
  Bottom 1.27: IC7.P$14 X8.1
N$22
  Bottom 1.27: IC7.P$13 X8.2
N$23
  Bottom 1.27: IC7.P$12 X8.3
N$24
  Bottom 1.27: IC7.P$11 X8.4
N$25
  Bottom 1.27: IC8.P$14 X9.1
N$26
  Bottom 1.27: IC8.P$13 X9.2
N$27
  Bottom 1.27: IC8.P$12 X9.3
N$28
  Bottom 1.27: IC8.P$11 X9.4
N$29
  Bottom 1.27: S1.4 IC4.P$4
N$30
  Bottom 1.27: S1.5 IC4.P$3
N$31
  Bottom 1.27: S1.6 IC4.P$2
N$32
  Bottom 1.27: S2.6 IC5.P$2
N$33
  Bottom 1.27: S2.5 IC5.P$3
N$34
  Bottom 1.27: S2.4 IC5.P$4
N$35
  Bottom 1.27: S3.6 IC6.P$2
N$36
  Bottom 1.27: S3.5 IC6.P$3
N$37
  Bottom 1.27: S3.4 IC6.P$4
N$38
  Bottom 1.27: S4.6 IC7.P$2
N$39
  Bottom 1.27: S4.5 IC7.P$3
N$40
  Bottom 1.27: S4.4 IC7.P$4
N$41
  Bottom 1.27: S5.6 IC8.P$2
N$42
  Bottom 1.27: S5.5 IC8.P$3
N$43
  Bottom 1.27: S5.4 IC8.P$4
N$44
  Top 0.305: IC3.28 20.55,66.25 20.96,66.66 20.96,68.24
  Top 0.61: C18.1 20.96,73.11 20.96,68.24
N$45
  Top 0.305: X1.1 12.97,64.38 14.83,66.25 IC3.8 15.48,66.9 15.64,67.05 IC3.7
N$46
  Top 0.305: 62.55,101.26 62.55,96.5
  Top 0.61: VT4.G 62.55,96.5 | 62.55,96.5 | 62.55,96.5 52.07,86.02 R14.1 | R15.1 62.45,101.36 62.55,101.26
N$47
  Bottom 0.406: R5.W 19.37,33 X11.3
N$48
  Top 0.406: R23.1 19.37,71.74 13.02,78.08 X14.8
N$49
  Bottom 0.406: IC9.15 12.07,95.87 10.48,94.28 X14.1
N$50
  Bottom 0.406: IC9.12 14.6,92.05 X14.2
N$51
  Bottom 0.406: IC9.10 14.92,89.52 14.6,89.83 11.75,89.83 X14.5
N$52
  Bottom 0.406: IC10.4 4.76,85.38 4.13,86.02 3.27,86.02 C15.1
N$53
  Top 1.27: X3.3 31.78,111.85 VT2.D1
  pour Top (isolate 0.61): 39.37,125.07 39.37,114.6 36.2,114.6 36.2,102.85 29.85,102.85 29.85,125.07
N$55
  Top 0.61: U$1.7 U$1.8 81.62,118.41 | 81.62,118.41 U$1.1 | R18.2 R19.2 | R20.2 R19.2 | R19.2 81.6,118.43 81.62,118.41
N$56
  Top 0.61: U$1.2 76.26,117.14 75.5,117.9 D1.C
  Top 0.813: L2.P$1 74.04,119.36 75.5,117.9
N$57
  Top 0.61: C4.1 80.33,112.69 81.28,113.65 81.28,115.55 80.96,115.87 U$1.3
N$59
  Top 0.61: 85.02,112.28 R22.2 | 85.02,112.28 R21.1 | U$1.5 84.67,113.43 85.09,113.01 85.09,112.35 85.02,112.28
RX-1280  (via drill 0.7)
  Top 0.305: IC1.2 46.14,80.41 v46.67,80.94 | IC3.26 21.14,65.25 v21.91,66.02
  Bottom 0.305: v46.67,80.94 46.67,81.26
  Bottom 0.61: 46.67,81.26 44.13,83.8 32.7,83.8 20.96,72.05 20.96,66.97 v21.91,66.02
SD-MISO  (via drill 0.7)
  Top 0.305: IC1.22 36.14,81.63 35.82,81.95
  Top 0.61: 35.82,81.95 v31.43,86.34
  Bottom 0.406: X14.7 10.48,85.51 15.04,80.94
  Bottom 0.61: v31.43,86.34 26.03,80.94 15.04,80.94
SD-SS  (via drill 0.7)
  Top 0.305: IC1.19 37.64,83.31 36.2,84.75 36.2,90.47 33.65,93.01 v27.3,93.01
  Bottom 0.406: IC9.14 20,94.6 20.64,93.96 20.64,86.97 21.59,86.02 23.81,86.02 27.3,89.52 v27.3,93.01
SD_DET
  Top 0.305: IC1.35 30.39,71.01 29.21,69.83 29.21,68.24 25.72,64.75 23.81,64.75 23.18,65.38 23.18,66.97 22.13,68.02
  Top 0.406: 22.13,68.02 R23.2
SD_MOSI  (via drill 0.7)
  Top 0.305: IC1.21 36.64,82.4 34.61,84.43 34.61,87.29 v34.29,87.61
  Bottom 0.406: v34.29,87.61 35.56,88.88 35.56,90.79 34.92,91.42 30.8,91.42 24.76,85.39 24.13,84.75 20.64,84.75 19.69,85.71 19.69,89.83 18.73,90.79 IC9.11
SD_SCK  (via drill 0.7)
  Top 0.305: IC1.20 37.14,82.85 35.56,84.43 35.56,88.88 v34.29,90.15
  Bottom 0.406: v34.29,90.15 31.12,90.15 24.45,83.48 18.73,83.48 17.25,84.97 IC9.9
THERM-E0  (via drill 0.7)
  Top 0.305: IC1.84 54.71,67.51 v55.56,66.66
  Bottom 0.305: C12.1 55.56,62.72
  Bottom 0.406: R2.1 54.71,57.54 X17.1 55.88,62.4 C12.1
  Bottom 0.61: v55.56,66.66 55.56,62.72
THERM-E1  (via drill 0.7)
  Top 0.305: IC1.82 52.53,66.51 53.34,65.7 53.34,56.18
  Top 0.61: v54.29,47.29 53.02,48.56 53.02,55.86 53.34,56.18
  Bottom 0.305: C14.1 55.24,47.29
  Bottom 0.406: R4.1 54.71,42.3 X19.1 55.88,47.16 C14.1
  Bottom 0.61: 55.24,47.29 v54.29,47.29
THERM-HB  (via drill 0.7)
  Top 0.305: IC1.83 52.98,67.01 54.29,65.7
  Top 0.61: 54.29,65.7 v54.29,54.91
  Bottom 0.406: R3.1 54.71,49.92 X18.1 55.88,54.78 C13.1
  Bottom 0.61: C13.1 v54.29,54.91
TX-1280  (via drill 0.7)
  Top 0.305: IC1.3 45.64,80.39 v45.09,80.94 | IC3.25 21.27,64.75 v21.91,64.12
  Bottom 0.61: v45.09,80.94 43.5,82.53 33.34,82.53 22.23,71.42 22.23,68.24 23.49,66.97 23.49,65.07 22.54,64.12 v21.91,64.12
V-IN  (via drill 0.7)
  Top 0.305: v91.44,122.85 90.9,122.85 90.85,122.8
  Top 0.61: R20.1 R19.1 R18.1 | U$1.6 86.04,115.87 86.68,116.5 86.68,122.61 86.53,122.76
  Top 0.813: 86.53,122.76 R20.1 R19.1 R18.1 | v90.17,122.85 86.92,122.85 86.68,122.61
  Top 1.27: C23.+ C22.+ 83.98,83.48 IC5.P$16 | C24.+ C23.+ | C24.+ C25.+ 83.98,22.52 IC8.P$16 | IC7.P$16 83.98,42.84 C24.+ | IC6.P$16 83.98,63.16 C23.+ | IC4.P$16 83.98,103.8 C21.+
  Top 2.54: C22.+ C21.+ 82.07,105.23 83.82,106.98 96.84,106.98 97.79,107.93 97.79,117.46 | X4.P$1 95.57,119.68 97.79,117.46 | 97.79,117.46 97.79,121.9 96.89,122.8 90.85,122.8
  Bottom 1.27: 22.3,122.3 22.86,122.85 18.73,122.85 | X10.1 59.06,122.85 | 32.31,122.46 32.7,122.85 | 42.86,122.85 42.39,122.38
  Bottom 2.54: 22.86,122.85 32.7,122.85 42.86,122.85 59.06,122.85 v90.17,122.85 90.81,122.85 X4.P$1 | X2.1 32.31,122.46 | 22.3,122.3 X2.3 | 42.39,122.38 X3.2
X-DIR  (via drill 0.7)
  Top 0.305: IC1.96 53.53,73.51 55.24,75.23 v55.88,75.23
  Bottom 0.61: v55.88,75.23 56.52,75.23 67.31,86.02 IC4.P$8
X-EN  (via drill 0.7)
  Top 0.305: v38.1,70.15 38.1,66.66 34.96,63.51 IC1.50
  Bottom 0.61: IC4.P$1 73.98,103.8 71.44,101.26 71.44,94.28 47.31,70.15 v38.1,70.15
X-MIN  (via drill 0.7)
  Top 0.305: IC1.7 43.64,79.53 v43.5,79.67
  Top 0.61: v29.53,39.03 29.53,38.72 44.45,23.79 44.45,22.69 44.47,22.67 44.47,12.29 44.45,12.27 v44.45,6.97 X15.2
  Bottom 0.61: v43.5,79.67 42.54,79.67 40.32,77.45 33.65,77.45 29.85,73.64 29.85,54.91 30.8,53.95 30.8,40.3 v29.53,39.03 | R9.1 v44.45,6.97 C19.1
X-STEP  (via drill 0.7)
  Top 0.305: IC1.97 53.08,74.01 53.97,74.91 53.97,76.18 54.61,76.82 v55.88,76.82
  Bottom 0.61: IC4.P$7 67.95,88.56 56.2,76.82 v55.88,76.82
XTAL1
  Top 0.305: IC1.34 28.35,71.51 28.26,71.42 25.83,71.42 Q1.P$2 24.98,70.47 C1.2
XTAL2
  Top 0.305: IC1.33 27.54,72.01 Q1.P$4 27.21,72.39 C2.2
Y-DIR  (via drill 0.7)
  Top 0.305: IC1.90 55.83,70.51 v55.88,70.46
  Bottom 0.61: v55.88,70.46 71.76,70.46 76.52,65.7 IC5.P$8
Y-EN  (via drill 0.7)
  Top 0.305: IC1.95 54.3,73.01 54.93,73.64 v55.88,73.64
  Bottom 0.61: v55.88,73.64 56.83,73.64 66.68,83.48 IC5.P$1
Y-MIN  (via drill 0.7)
  Top 0.305: 42.54,58.4 41.28,59.66 41.14,59.8 IC1.64
  Top 0.406: 42.54,58.4 42.54,54.59 39.69,51.73
  Top 0.61: 39.69,51.73 28.57,51.73 26.99,50.15 26.99,33.32 37.78,22.52 v37.78,6.97
  Bottom 0.305: 37.15,6.97 R7.1 | 37.15,6.97 C17.1 | v37.78,6.97 37.15,6.97
  Bottom 1.27: X13.2 v37.78,6.97
Y-STEP  (via drill 0.7)
  Top 0.305: IC1.91 53.89,71.01 54.93,72.05 v55.88,72.05
  Bottom 0.61: v55.88,72.05 72.71,72.05 76.52,68.24 IC5.P$7
Z-DIR  (via drill 0.7)
  Top 0.305: v36.51,67.61 36.51,69.19 35.72,69.99 34.92,69.99 34.4,70.51 IC1.36
  Bottom 0.305: 49.85,62.53 50.17,62.21 50.17,59.04 50.8,58.4 50.8,40.94 53.02,38.72
  Bottom 0.61: 53.02,38.72 60.32,38.72 66.99,45.38 IC6.P$8 | 49.85,62.53 44.77,67.61 v36.51,67.61
Z-EN  (via drill 0.7)
  Top 0.305: IC1.89 53.79,70.01 54.93,68.88 v55.88,68.88
  Bottom 0.61: v55.88,68.88 70.8,68.88 76.52,63.16 IC6.P$1
Z-MIN  (via drill 0.7)
  Top 0.305: IC1.46 28.39,65.51 v25.4,62.53
  Top 0.406: v25.4,50.46 25.4,12.05 v30.48,6.97
  Bottom 0.305: 29.85,6.97 R6.1 | 29.85,6.97 C16.1 | v30.48,6.97 29.85,6.97
  Bottom 0.61: v25.4,62.53 v25.4,50.46
  Bottom 1.27: X12.2 v30.48,6.97
Z-STEP  (via drill 0.7)
  Top 0.305: IC1.38 34.29,69.51 v34.92,68.88
  Bottom 0.305: 50.8,63.16 50.8,59.67 51.43,59.04 51.43,41.89 53.02,40.3
  Bottom 0.61: v34.92,68.88 45.09,68.88 50.8,63.16 | 53.02,40.3 60.01,40.3 67.63,47.92 IC6.P$7

### Text on the board
Top: E0 | E1 | HB | FAN | X | Y | T-E0 | Z | T-HB | T-E1 | E0 | Z-MIN | Y-MIN | X-MIN | E1
tCream: 12V | E0 | E1 | HB | FAN | X | Y | Z | E0 | Z-MIN | Y-MAX | X-MAX | 1 | E1